# EAGLE design BSPD_RevE (EAGLE 9.2.0)
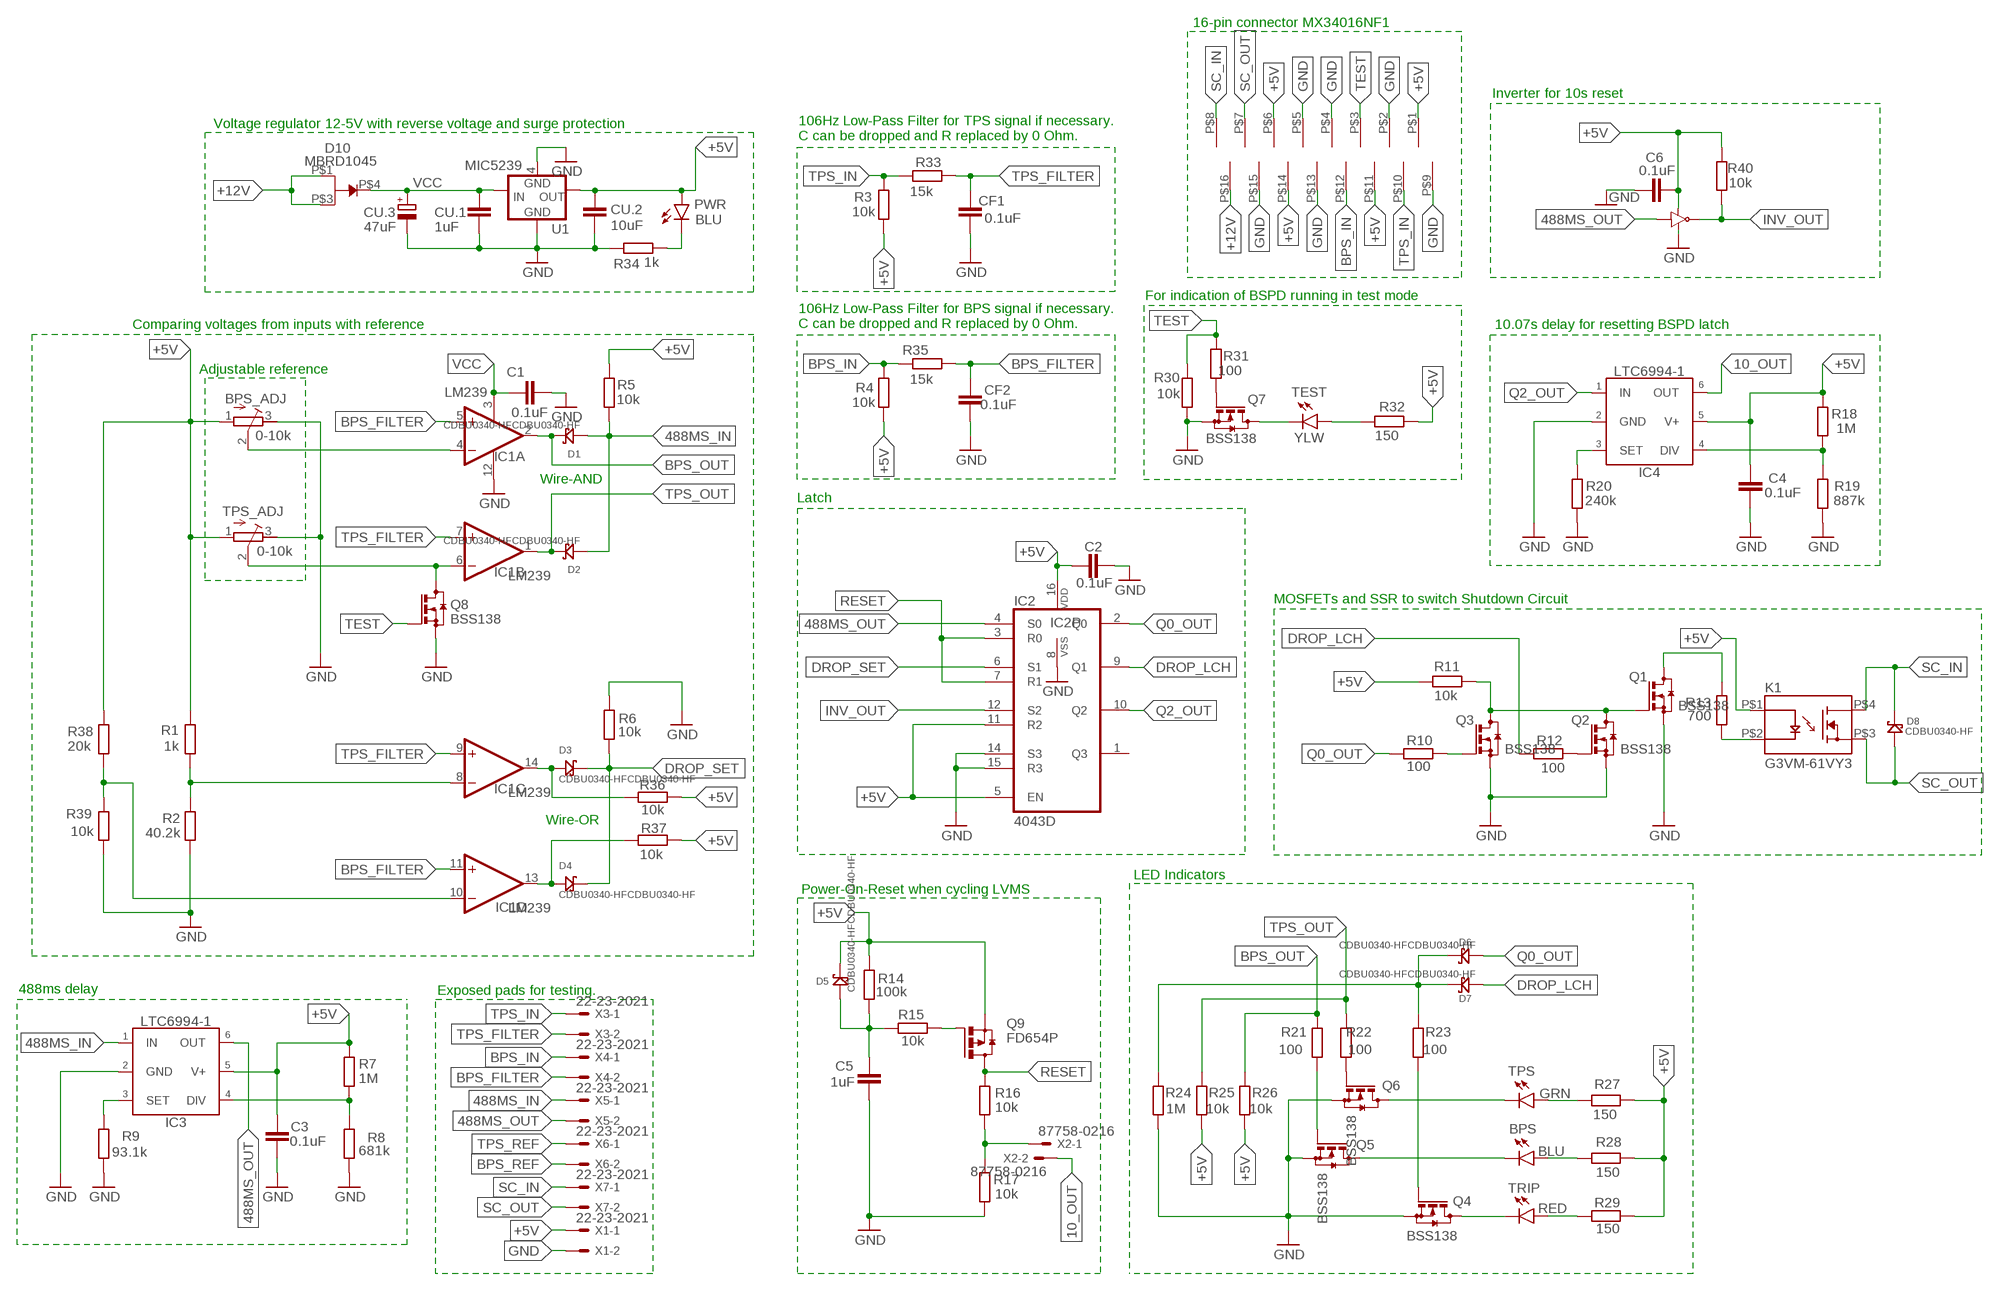
[diagram p0: schematic, sheet 1]

## Parts
BPS  BLU  LEDSML1206  [SML1206]
BPS_ADJ  0-10k  R-TRIMM3296W  [RTRIM3296W]
C1  0.1uF  C-EUC0603  [C0603]
C2  0.1uF  C-EUC0603  [C0603]
C3  0.1uF  C-EUC0603  [C0603]
C4  0.1uF  C-EUC0603  [C0603]
C5  1uF  C-EUC0603  [C0603]
C6  0.1uF  C-EUC0603  [C0603]
CF1  0.1uF  C-EUC0603  [C0603]
CF2  0.1uF  C-EUC0603  [C0603]
CU.1  1uF  C-EUC0603  [C0603]
CU.2  10uF  C-EUC0603  [C0603]
CU.3  47uF  CPOL-EUE2-5  [E2-5]
D1  CDBU0340-HFCDBU0340-HF  [DIOM1709X85]
D2  CDBU0340-HFCDBU0340-HF  [DIOM1709X85]
D3  CDBU0340-HFCDBU0340-HF  [DIOM1709X85]
D4  CDBU0340-HFCDBU0340-HF  [DIOM1709X85]
D5  CDBU0340-HFCDBU0340-HF  [DIOM1709X85]
D6  CDBU0340-HFCDBU0340-HF  [DIOM1709X85]
D7  CDBU0340-HFCDBU0340-HF  [DIOM1709X85]
D8  CDBU0340-HF  CDBU0340-HFCDBU0340-HF  [DIOM1709X85]
D10  MBRD1045  [DPAK]
IC1  LM239  LM2901D  [SO14]
IC2  4043D  [SO16]
IC3  LTC6994-1  [TSOT23-6]
IC4  LTC6994-1  [TSOT23-6]
K1  G3VM-61VY3  [SOP-4]
P1  MX34016NF1  [MX34016NF1]
PWR  BLU  LEDSML1206  [SML1206]
Q1  BSS138  BSS123  [SOT23]
Q2  BSS138  BSS123  [SOT23]
Q3  BSS138  BSS123  [SOT23]
Q4  BSS138  BSS123  [SOT23]
Q5  BSS138  BSS123  [SOT23]
Q6  BSS138  BSS123  [SOT23]
Q7  BSS138  BSS123  [SOT23]
Q8  BSS138  BSS123  [SOT23]
Q9  FD654P  [SOT-23-6]
R1  1k  R-EU_R0603  [R0603]
R2  40.2k  R-EU_R0603  [R0603]
R3  10k  R-EU_R0603  [R0603]
R4  10k  R-EU_R0603  [R0603]
R5  10k  R-EU_R0603  [R0603]
R6  10k  R-EU_R0603  [R0603]
R7  1M  R-EU_R0603  [R0603]
R8  681k  R-EU_R0603  [R0603]
R9  93.1k  R-EU_R0603  [R0603]
R10  100  R-EU_R0603  [R0603]
R11  10k  R-EU_R0603  [R0603]
R12  100  R-EU_R0603  [R0603]
R13  700  R-EU_R0603  [R0603]
R14  100k  R-EU_R0603  [R0603]
R15  10k  R-EU_R0603  [R0603]
R16  10k  R-EU_R0603  [R0603]
R17  10k  R-EU_R0603  [R0603]
R18  1M  R-EU_R0603  [R0603]
R19  887k  R-EU_R0603  [R0603]
R20  240k  R-EU_R0603  [R0603]
R21  100  R-EU_R0603  [R0603]
R22  100  R-EU_R0603  [R0603]
R23  100  R-EU_R0603  [R0603]
R24  1M  R-EU_R0603  [R0603]
R25  10k  R-EU_R0603  [R0603]
R26  10k  R-EU_R0603  [R0603]
R27  150  R-EU_R0603  [R0603]
R28  150  R-EU_R0603  [R0603]
R29  150  R-EU_R0603  [R0603]
R30  10k  R-EU_R0603  [R0603]
R31  100  R-EU_R0603  [R0603]
R32  150  R-EU_R0603  [R0603]
R33  15k  R-EU_R0603  [R0603]
R34  1k  R-EU_R0603  [R0603]
R35  15k  R-EU_R0603  [R0603]
R36  10k  R-EU_R0603  [R0603]
R37  10k  R-EU_R0603  [R0603]
R38  20k  R-EU_R0603  [R0603]
R39  10k  R-EU_R0603  [R0603]
R40  10k  R-EU_R0603  [R0603]
TEST  YLW  LEDSML1206  [SML1206]
TPS  GRN  LEDSML1206  [SML1206]
TPS_ADJ  0-10k  R-TRIMM3296W  [RTRIM3296W]
TRIP  RED  LEDSML1206  [SML1206]
U1  MIC5239  [SOT223]
U2  74LVC1G06  [SOT353-1]
X1  22-23-2021  [22-23-2021]
X2  87758-0216  [87758-0216]
X3  22-23-2021  [22-23-2021]
X4  22-23-2021  [22-23-2021]
X5  22-23-2021  [22-23-2021]
X6  22-23-2021  [22-23-2021]
X7  22-23-2021  [22-23-2021]

## Nets
10_OUT: IC4.6(OUT) X2.2
488MS_IN: D1.2$A(A) D2.2$A(A) IC3.1(IN) R5.1 X5.1
488MS_OUT [Min]: IC2.4(S0) IC3.6(OUT) U2.P$2(A) X5.2
+5V: BPS_ADJ.1(A) C2.1 C3.2 C4.2 C6.2 CU.2.1 D5.1$K(K) IC2.5(EN) IC2.11(R2) IC2.16(VDD) IC3.5(V+) IC4.5(V+) K1.P$1 P1.P$1 P1.P$6 P1.P$11 P1.P$14 PWR.A Q9.4(S) R1.2 R3.1 R4.1 R5.2 R7.2 R11.2 R14.2 R18.2 R25.1 R26.1 R27.2 R28.2 R29.2 R32.2 R36.1 R37.1 R38.2 R40.2 TPS_ADJ.1(A) U1.3(OUT) U2.P$5(VCC) X1.1
+12V: D10.P$1 D10.P$3 P1.P$16
BPS_DROP: D4.2$A(A) IC1.13(D:OUT) R37.2
BPS_FILTER: CF2.2 IC1.5(A:+IN) IC1.11(D:+IN) R35.1 X4.2
BPS_IN: P1.P$12 R4.2 R35.2 X4.1
BPS_OUT: D1.1$K(K) IC1.2(A:OUT) R21.2 R26.2
BPS_REF: BPS_ADJ.2(S) IC1.4(A:-IN) X6.2
DROP_LCH: D7.2$A(A) IC2.9(Q1) R12.2
DROP_SET: D3.1$K(K) D4.1$K(K) IC2.6(S1) R6.1
GND: BPS_ADJ.3(E) C1.2 C2.2 C3.1 C4.1 C5.1 C6.1 CF1.1 CF2.1 CU.1.2 CU.2.2 CU.3.- IC1.12(P:V-) IC2.8(VSS) IC2.14(S3) IC2.15(R3) IC3.2(GND) IC4.2(GND) P1.P$2 P1.P$4 P1.P$5 P1.P$9 P1.P$13 P1.P$15 Q1.2(S) Q2.2(S) Q3.2(S) Q4.2(S) Q5.2(S) Q6.2(S) Q7.2(S) Q8.2(S) R2.1 R6.2 R8.1 R9.1 R17.2 R19.1 R20.1 R24.1 R30.1 R34.1 R39.1 TPS_ADJ.3(E) U1.2(GND) U1.4(GND_TAB) U2.P$3(GND) X1.2
INV_OUT: IC2.12(S2) R40.1 U2.P$4(Y)
LED_DROP: Q7.3(D) TEST.C
N$1: R16.2 R17.1 X2.1
N$2: Q1.3(D) R13.2
N$5: IC1.8(C:-IN) R1.1 R2.2
N$9: IC3.4(DIV) R7.1 R8.2
N$10: Q1.1(G) Q2.3(D) Q3.3(D) R11.1
N$11: R27.1 TPS.A
N$12: BPS.A R28.1
N$13: BPS.C Q5.3(D)
N$14: Q6.3(D) TPS.C
N$15: R29.1 TRIP.A
N$16: Q4.3(D) TRIP.C
N$17: Q2.1(G) R12.1
N$18: C5.2 D5.2$A(A) R14.1 R15.2
N$19: PWR.C R34.2
N$23: K1.P$2 R13.1
N$24: Q5.1(G) R21.1
N$25: Q6.1(G) R22.1
N$27: Q4.1(G) R23.1
N$28: R32.1 TEST.A
N$31: IC4.4(DIV) R18.1 R19.2
N$32: IC4.3(SET) R20.2
N$33: Q3.1(G) R10.2
N$36: Q7.1(G) R31.1
N$38: IC3.3(SET) R9.2
N$40: D6.1$K(K) D7.1$K(K) R23.2 R24.2
N$41: Q9.3(G) R15.1
N$43: IC1.10(D:-IN) R38.1 R39.2
Q0_OUT: D6.2$A(A) IC2.2(Q0) R10.1
Q2_OUT: IC2.10(Q2) IC4.1(IN)
RESET: IC2.3(R0) IC2.7(R1) Q9.1(D) Q9.2(D) Q9.5(D) Q9.6(D) R16.1
SC_IN: D8.1$K(K) K1.P$4 P1.P$8 X7.1
SC_OUT: D8.2$A(A) K1.P$3 P1.P$7 X7.2
TEST: P1.P$3 Q8.1(G) R30.2 R31.2
TPS_DROP: D3.2$A(A) IC1.14(C:OUT) R36.2
TPS_FILTER: CF1.2 IC1.7(B:+IN) IC1.9(C:+IN) R33.1 X3.2
TPS_IN: P1.P$10 R3.2 R33.2 X3.1
TPS_OUT: D2.1$K(K) IC1.1(B:OUT) R22.2 R25.2
TPS_REF: IC1.6(B:-IN) Q8.3(D) TPS_ADJ.2(S) X6.1
VCC: C1.1 CU.1.1 CU.3.+ D10.P$4 IC1.3(P:V+) U1.1(IN)
Unconnected: IC2.1(Q3)

## Notes on the sheet
- 16-pin connector MX34016NF1
- Inverter for 10s reset
- Voltage regulator 12-5V with reverse voltage and surge protection
- 106Hz Low-Pass Filter for TPS signal if necessary.
  C can be dropped and R replaced by 0 Ohm.
- For indication of BSPD running in test mode
- Comparing voltages from inputs with reference | 10.07s delay for resetting BSPD latch
- 106Hz Low-Pass Filter for BPS signal if necessary.
  C can be dropped and R replaced by 0 Ohm.
- Adjustable reference
- Wire-AND
- Latch
- MOSFETs and SSR to switch Shutdown Circuit
- Wire-OR
- LED Indicators
- Power-On-Reset when cycling LVMS
- 488ms delay | Exposed pads for testing.

## Library data of the parts
BPS PWR TEST TPS TRIP = led:LED: LED OSRAM: - CHIPLED LG R971, LG N971, LY N971, LG Q971, LY Q971, LO R971, LY R971 LH N974, LH R974 LS Q976, LO Q976, LY Q976 LO Q996 - Hyper CHIPLED LW Q18S LB Q993, LB Q99A, LB R99A - SideLED LS A670, LO A670, LY A670, LG A670, LP A670 LB A673, LV A673, LT A673, LW A673 LH A674 LY A675 LS A676, LA A676, LO A676, LY A676, LW A676 LS A679, LY A679, LG A679 - Hyper Micro SIDELED® LS Y876, LA Y876, LO Y876, LY Y876 LT Y87S - SmartLED LW L88C, LW L88S LB L89C, LB L89S, LG L890 LS L89K, LO L89K, LY L89K LS L896, LA L896, LO L896, LY L896 - TOPLED LS T670, LO T670, LY T670, LG T670, LP T670 LSG T670, LSP T670, LSY T670, LOP T670, LYG T670 LG T671, LOG T671, LSG T671 LB T673, LV T673, LT T673, LW T673 LH T674 LS T676, LA T676, LO T676, LY T676, LB T676, LH T676, LSB T676, LW T676 LB T67C, LV T67C, LT T67C, LS T67K, LO T67K, LY T67K, LW E67C LS E67B, LA E67B, LO E67B, LY E67B, LB E67C, LV E67C, LT E67C LW T67C LS T679, LY T679, LG T679 LS T770, LO T770, LY T770, LG T770, LP T770 LB T773, LV T773, LT T773, LW T773 LH T774 LS E675, LA E675, LY E675, LS T675 LS T776, LA T776, LO T776, LY T776, LB T776 LHGB T686 LT T68C, LB T68C - Hyper Mini TOPLED® LB M676 - Mini TOPLED Santana® LG M470 LS M47K, LO M47K, LY M47K Source: http://www.osram.convergy.de LUXEON: - LUMILED® LXK2-PW12-R00, LXK2-PW12-S00, LXK2-PW14-U00, LXK2-PW14-V00 LXK2-PM12-R00, LXK2-PM12-S00, LXK2-PM14-U00 LXK2-PE12-Q00, LXK2-PE12-R00, LXK2-PE12-S00, LXK2-PE14-T00, LXK2-PE14-U00 LXK2-PB12-K00, LXK2-PB12-L00, LXK2-PB12-M00, LXK2-PB14-N00, LXK2-PB14-P00, LXK2-PB14-Q00 LXK2-PR12-L00, LXK2-PR12-M00, LXK2-PR14-Q00, LXK2-PR14-R00 LXK2-PD12-Q00, LXK2-PD12-R00, LXK2-PD12-S00 LXK2-PH12-R00, LXK2-PH12-S00 LXK2-PL12-P00, LXK2-PL12-Q00, LXK2-PL12-R00 Source: www.luxeon.com KINGBRIGHT: KA-3528ASYC Source: www.kingbright.com
BPS_ADJ TPS_ADJ = rcl:R-TRIMM: Trimm resistor; SPICEMODEL: X; SPICEPREFIXL: POT
C1-C6 CF1 CF2 CU.1 CU.2 = rcl:C-EU: CAPACITOR, European symbol; SPICEPREFIX: C
CU.3 = rcl:CPOL-EU: POLARIZED CAPACITOR, European symbol; SPICEPREFIX: C
D1-D7 = BSPD:CDBU0340-HF
D8 = AR19_ETC:CDBU0340-HF
D10 = AR19_ETC:MBRD1045
IC1 = linear:LM2901: COMPARATOR
IC2 = 40xx:4043: Quad 3-state NOR R/S LATCH
IC3 IC4 = div1:LTC6994-1: TimerBlox Retriggerable One Edge Delay; SPICEMODEL: LTC6994-1.sub; VALUE2: LTC6994-1
K1 = AR19_ETC:G3VM-61VY3
P1 = AR19_ETC:MX34016NF1
Q1-Q8 = transistor-small-signal:BSS123: N-CHANNEL MOS FET
Q9 = BSPD:FD654P
R1-R40 = rcl:R-EU_: RESISTOR, European symbol; SPICEPREFIX: R
U1 = BSPD:MIC5239
U2 = AR19_ETC:74LVC1G06
X1 X3-X7 = con-molex:22-23-2021: .100" (2.54mm) Center Header - 2 Pin; MF: MOLEX; MPN: 22-23-2021; OC_FARNELL: 1462926; OC_NEWARK: 25C3832
X2 = con-molex:87758-0216: 2 Pin - 2mm Dual Row Single Wafer, Vertical T/H HDR Source: http://www.molex.com/pdm_docs/sd/877580616_sd.pdf; MF: MOLEX; MPN: 87758-0216; OC_FARNELL: unknown; OC_NEWARK: 94M1513

## Net classes
0 default: width 0.152 mm, drill 0.3 mm, clearance 0.127 mm
1 PWR: width 0.762 mm, drill 0.254 mm, clearance 0.127 mm
2 GND: width 0.762 mm, drill 0.254 mm, clearance 0.127 mm
3 Min: width 0.152 mm, drill 0.254 mm, clearance 0.127 mm

## Board
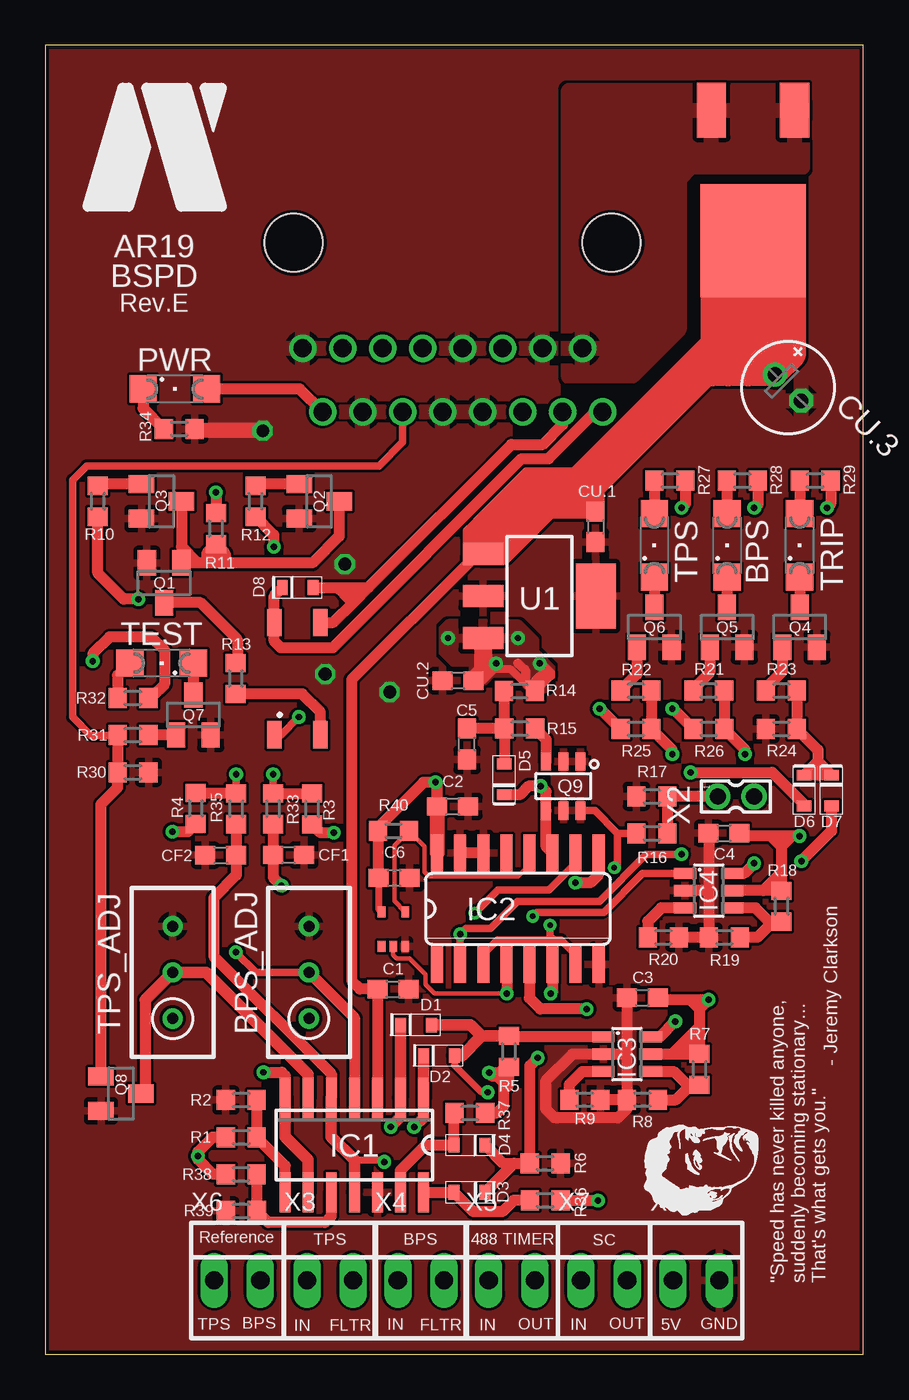
[diagram p1: board, top side]
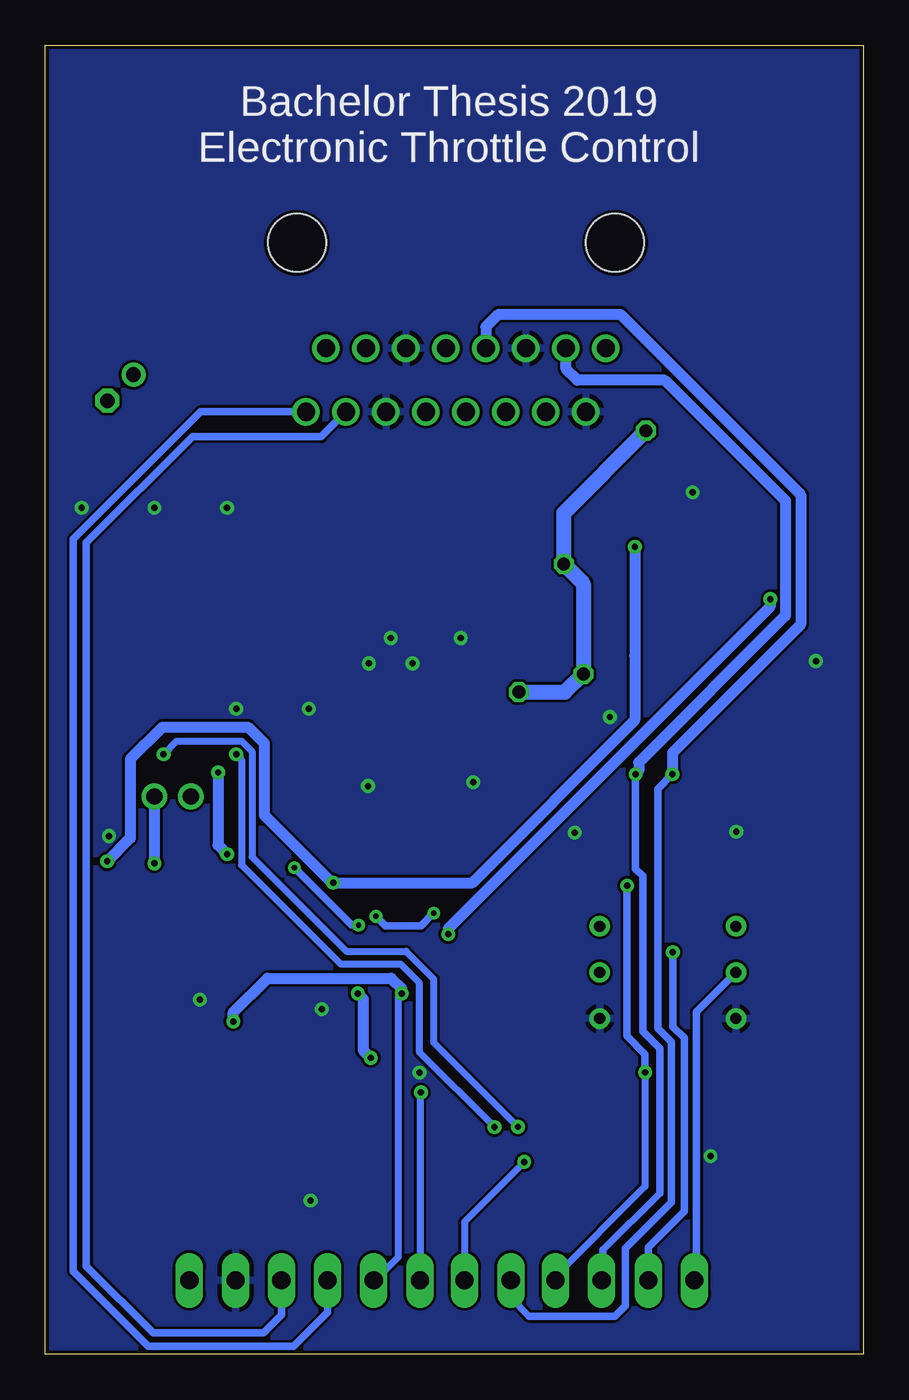
[diagram p2: board, bottom side, seen from below]

Size 45 x 72 mm. Coordinates in mm from the lower left corner, seen from the top.
Outline: 0,0 45,0 45,72 0,72 0,0
Copper layers (1*16): Top 0.035mm / dielectric 1.5mm / Bottom 0.035mm
Design rules "default *": minimum track width 6mil, minimum drill 0.3mm, track to track 6mil, track to pad 6mil, pad to pad 6mil, via to via 6mil, smd to smd 6mil, copper to edge 0.2mm, drill to drill 6mil, minimum pad ring 10mil, minimum via ring 8mil, stop-mask expansion 4mil, vias tented up to drill 0mil, thermal gap 10mil

### Footprints (pad centres in the part's own frame; a part is rotated, then mirrored left to right if it is on the bottom)
SML1206 = smd 1.5 x 1.5: A 1.75,0; C -1.75,0
RTRIM3296W = drill 0.61: 1 0,-2.54; 2 0,0; 3 0,2.54
C0603 = smd 1.1 x 1: 1 -0.85,0; 2 0.85,0
E2-5 = drill 0.813 pad 1.27: + -1.016,0 | drill 0.813 pad 1.27 octagon: - 1.016,0
DIOM1709X85 = smd 0.6 x 0.8: 1$K -0.85,0; 2$A 0.85,0
DPAK = smd 3 x 1.6: P$1 0,0; P$3 0,4.57 | smd 6.2 x 5.8: P$4 -7.18,2.285
SO14 = smd 0.6 x 2.2: 1 -3.81,-2.6; 2 -2.54,-2.6; 3 -1.27,-2.6; 4 0,-2.6; 5 1.27,-2.6; 6 2.54,-2.6; 7 3.81,-2.6; 8 3.81,2.6; 9 2.54,2.6; 10 1.27,2.6; 11 0,2.6; 12 -1.27,2.6; 13 -2.54,2.6; 14 -3.81,2.6
SO16 = smd 0.66 x 2.032: 1 -4.445,-3.073; 2 -3.175,-3.073; 3 -1.905,-3.073; 4 -0.635,-3.073; 5 0.635,-3.073; 6 1.905,-3.073; 7 3.175,-3.073; 8 4.445,-3.073; 9 4.445,3.073; 10 3.175,3.073; 11 1.905,3.073; 12 0.635,3.073; 13 -0.635,3.073; 14 -1.905,3.073; 15 -3.175,3.073; 16 -4.445,3.073
TSOT23-6 = smd 0.62 x 1.22: 1 -0.95,-1.3; 2 0,-1.3; 3 0.95,-1.3; 4 0.95,1.3; 5 0,1.3; 6 -0.95,1.3
SOP-4 = smd 0.8 x 1.5: P$1 0,0; P$2 2.54,0; P$3 2.54,6.18; P$4 0,6.18
MX34016NF1 = drill 1: P$1 0,0; P$2 -2.2,0; P$3 -4.4,0; P$4 -6.6,0; P$5 -8.8,0; P$6 -11,0; P$7 -13.2,0; P$8 -15.4,0; P$9 1.1,-3.5; P$10 -1.1,-3.5; P$11 -3.3,-3.5; P$12 -5.5,-3.5; P$13 -7.7,-3.5; P$14 -9.9,-3.5; P$15 -12.1,-3.5; P$16 -14.3,-3.5 | hole 3.2: -15.9,-9.3; 1.6,-9.3
SOT23 = smd 1 x 1.4: 1 -0.95,-1.1; 2 0.95,-1.1; 3 0,1.1
SOT-23-6 = smd 1 x 0.55: 1 -1.35,0.95; 2 -1.35,0; 3 -1.35,-0.95; 4 1.35,-0.95; 5 1.35,0; 6 1.35,0.95
R0603 = smd 1 x 1.1: 1 -0.85,0; 2 0.85,0
SOT223 = smd 1.219 x 2.235: 1 -2.311,-3.099; 2 0,-3.099; 3 2.311,-3.099 | smd 3.6 x 2.2: 4 0,3.099
SOT353-1 = smd 0.42 x 0.6: P$1 -0.65,0; P$2 0,0; P$3 0.65,0; P$4 0.65,1.9; P$5 -0.65,1.9
22-23-2021 = drill 1 long: 1 -1.27,0; 2 1.27,0
87758-0216 = drill 0.9 pad 1.27: 1 0,-1; 2 0,1

### Placement (x,y rotation side)
BPS  37.51,44.5 90 top
BPS_ADJ  14.5,21 0 top
C1  19.12,20.08 0 top
C2  22.41,30.13 0 top
C3  32.85,19.61 0 top
C4  37.34,28.66 0 top
C5  23.2,33.56 90 top
C6  19.19,26.19 180 top
CF1  13.38,27.46 180 top
CF2  9.65,27.45 0 top
CU.1  30.27,45.52 270 top
CU.2  22.71,37.05 180 top
CU.3  40.87,53.17 315 top
D1  20.4,18.11 0 top
D2  21.66,16.42 0 top
D3  23.34,8.9 180 top
D4  23.33,11.5 180 top
D5  25.24,31.62 90 top
D6  41.75,31 270 top
D7  43.25,31 270 top
D8  13.89,42.17 0 top
D10  41.23,68.44 90 top
IC1  17,11.5 180 top
IC2  26,24.5 0 top
IC3  32,16.5 270 top
IC4  36.5,25.5 270 top
K1  12.59,34.07 0 top
P1  15.26,51.84 180 top
PWR  7.13,53.1 0 top
Q1  6.53,42.43 180 top
Q2  15.06,46.92 270 top
Q3  6.38,46.92 270 top
Q4  41.51,40 0 top
Q5  37.51,40 0 top
Q6  33.51,40 0 top
Q7  8.14,35.16 0 top
Q8  4.16,14.33 270 top
Q9  28.5,31.25 270 top
R1  10.78,11.93 180 top
R2  10.78,13.98 0 top
R3  14.69,30 90 top
R4  8.28,30.02 90 top
R5  25.5,16.65 270 top
R6  27.5,10.5 0 top
R7  35.99,15.66 90 top
R8  32.85,14 0 top
R9  29.68,14 180 top
R10  2.88,46.92 90 top
R11  9.38,45.42 90 top
R12  11.56,46.92 270 top
R13  10.48,37.17 90 top
R14  26.09,36.47 0 top
R15  26.1,34.41 180 top
R16  33.37,28.65 0 top
R17  33.37,30.68 180 top
R18  40.5,24.64 90 top
R19  37.36,22.93 0 top
R20  34,22.93 180 top
R21  36.5,36.5 0 top
R22  32.5,36.5 0 top
R23  40.5,36.5 0 top
R24  40.5,34.4 0 top
R25  32.5,34.4 0 top
R26  36.51,34.4 0 top
R27  34.37,48.06 0 top
R28  38.36,48.06 0 top
R29  42.36,48.06 0 top
R30  4.82,32.01 180 top
R31  4.82,34.06 180 top
R32  4.82,36.1 0 top
R33  12.53,30 90 top
R34  7.37,50.9 180 top
R35  10.5,30 90 top
R36  27.51,8.47 180 top
R37  23.35,13.26 180 top
R38  10.78,9.9 180 top
R39  10.78,7.87 0 top
R40  19.16,28.78 180 top
TEST  6.4,38.02 180 top
TPS  33.51,44.5 90 top
TPS_ADJ  7,21 0 top
TRIP  41.51,44.5 90 top
U1  27.19,41.71 270 top
U2  19.15,22.43 0 top
X1  35.81,4.05 0 top
X2  38,30.68 270 top
X3  15.66,4.05 0 top
X4  20.66,4.05 0 top
X5  25.66,4.05 0 top
X6  10.55,4.05 0 top
X7  30.74,4.05 0 top

### Tracks (layer width: path | path; a pad name or v marks a point on that pad's centre or on a via)
10_OUT  (via drill 0.35)
  Top 0.61: v39,27 38.45,26.45 IC4.6
  Bottom 0.61: v39,27 X2.2
488MS_IN  (via drill 0.35)
  Top 0.381: D2.2$A 22.51,15.89 24,14.4 v24.34,14.4
  Top 0.61: IC3.1 25.55,17.45 R5.1
  Top 0.635: D2.2$A 22.92,16.42 24,17.5 | D1.2$A 23.39,18.11 24,17.5 | R5.1 24,17.5
  Bottom 0.381: v24.34,14.4 24.39,14.35 X5.1
488MS_OUT  (via drill 0.35)
  Top 0.254: v25.39,19.84 21.4,19.84 20.9,20.34 20.9,20.9 20.03,21.77 19.33,21.77 19.14,21.96 19.14,22.43 U2.P$2
  Top 0.61: IC3.6 33.8,17.45 v34.65,18.3 v34.66,18.3 | IC2.4 25.39,21.4 v25.39,19.84
  Bottom 0.381: v25.39,19.84 25.59,19.64 25.59,5.33 26.84,4.08 X5.2
  Bottom 0.61: v25.39,19.84 25.39,20.09 25.97,20.68 32.78,20.68 34.66,18.8 v34.66,18.3
+5V  (via drill 0.35)
  Top 0.381: C6.2 18.34,24.49 U2.P$5
  Top 0.4: v13.94,35.05 12.96,34.07 K1.P$1 | 24.71,37.69 25.58,37.69 26.8,36.47 R14.2 | 24.71,37.69 24.09,37.69 | 24.71,37.69 24.07,37.05 CU.2.1 | 24.71,37.69 24.09,38.31 24.09,38.62
  Top 0.508: R14.2 26.44,36.97 26.44,37.6 26,38 | R14.2 27.79,37.32 27.79,37.48 27.59,37.68 | 27.59,37.68 27.23,38.04 v27.2,38 | R14.2 26.94,37.02 27.59,37.68
  Top 0.6: R38.2 9.21,9.9 8.39,10.71 v8.39,10.89 8.39,11.13 9.19,11.93 R1.2 | IC2.11 27.55,27.93 Q9.4 | v27.25,31.25 26.59,31.25 26.11,30.77 D5.1$K | P1.P$1 14,53.1 PWR.A | v21.46,31.46 20.8,31.46 18.31,28.98 R40.2 18.31,26.22 C6.2
  Top 0.61: R4.1 7.84,28.73 v6.99,28.73 v6.98,28.73 | R5.2 25.31,15.8 24.99,15.48 v24.41,15.48 24.6,15.3 24.85,15.3 25.21,14.94 | 39.5,25.5 IC4.5 | R18.2 39.5,25.5 | R18.2 | C4.2 38.35,28.5 39.91,28.5 | 40.5,28.5 v41.5,28.5 41.07,28.5 40.49,27.92 39.91,28.5 | 40.5,28.5 39.91,28.5 | 40.49,26.49 40.49,28.49 40.5,28.5 | 40.49,26.49 R18.2 | 40.49,26.49 39.5,25.5 | v9.38,47.42 R11.2 | 35.48,19.5 v36.5,19.5 35.99,18.99 | 35.48,19.5 33.81,19.5 C3.2 | 35.99,18.99 35.99,18 | 35.99,18 35.99,17.5 | 35.99,17.5 R7.2 35,16.51 | 35.99,18.99 35.48,19.5 | IC3.5 34.5,16.51 | 34.5,16.51 35,16.51 | 34.5,16.51 35.99,18 | 35,16.51 35.99,17.5 | R27.2 35.22,46.77 v35.01,46.56 | R28.2 39.21,46.76 v39.01,46.56 | R29.2 43.21,46.76 v43.01,46.56 | R32.2 5.72,36.15 5.85,36.15 6.55,36.85 6.55,38.74 5.82,39.46 3.53,39.46 2.6,38.53 v2.6,38.13 | v34.5,35.5 34.56,35.5 R26.1 | v30.5,35.5 30.55,35.5 R25.1 | Q9.4 27.55,30.95 v27.25,31.25 | v30.41,8.44 28.38,8.44 R36.1 | 25.21,14.94 25.21,14.53 | 25.21,14.53 25.21,13.64 24.82,13.25 24.21,13.25 R37.1 | R5.2 25.21,15.51 25.21,14.94 | 25.21,14.53 25.5,14.82 R5.2 | v15.88,28.68 15.15,28.68 R3.1 | v29.79,18.98 27.24,18.98 26.64,19.59 IC2.5
  Top 0.635: C2.1 21.56,31.37 v21.46,31.46
  Top 0.813: C2.1 IC2.16
  Top 1: U1.3 24.09,38.62 24.09,37.69 24.09,37.59 CU.2.1
  other vias: 22.15,39.4 26,39.4 24.8,38
  pour Bottom (rank 2): -1,72.78 46,72.78 46,-1 -1,-1
  pour Top: 24.33,40.18 22.18,40.18 21.87,39.88 21.87,38.63 22.19,38.32 22.43,38.07 22.85,38.07 23.51,37.4 23.51,37.01 24.12,37.01 24.58,37.47 25.81,37.47 26.66,36.62 27.56,36.62 27.82,36.89 27.82,37.74 26.93,38.63 26.93,39.26 26.03,40.16
+12V
  pour Top: 28.78,53.78 28.78,69.53 41.65,69.53 41.65,65.3 35.52,65.3 34.88,64.65 34.88,56.39 32.31,53.82
BPS_DROP
  Top 0.61: IC1.13 19.54,10.11 20.93,11.5 D4.2$A 22.48,13.24 R37.2
BPS_FILTER  (via drill 0.35)
  Top 0.381: 17,10.7 18.52,10.7 v18.65,10.57
  Top 0.61: R35.1 CF2.2 10.5,26.35 9.26,25.11 9.26,21.88 15.73,15.41 IC1.5
  Top 0.635: IC1.11 17,10.7 15.73,11.96 IC1.5 | IC1.11
  Bottom 0.381: v18.65,10.57 21.93,7.29 X4.2
BPS_IN  (via drill 0.35)
  Top 0.4: v10.5,31.9 R35.2
  Top 0.61: R4.2 10.48,30.87 R35.2
  Bottom 0.381: 19.39,3.08 18.39,2.08
  Bottom 0.4: v10.5,31.9 11.3,31.1 11.3,17.93
  Bottom 0.406: 18.39,2.08 13.66,2.08 13.09,2.67 13.09,5.82 10.55,8.35 10.55,17.18 11.3,17.93 | X4.1 19.39,3.08
  Bottom 0.6: v10.5,31.9 10.5,33.07 3.44,40.13 3.44,47.28 13.37,57.21 20.07,57.21 20.76,56.52 P1.P$12
BPS_OUT  (via drill 0.35)
  Top 0.61: R21.2 R26.2 38.5,33.26 v38.5,33 | IC1.2 19.54,13.04 v19,12.5
  Top 0.635: IC1.2 D1.1$K
  Bottom 0.381: v19,12.5 23.64,17.14 23.64,20.64 25.16,22.16 28.44,22.16 33.64,27.36 33.64,33.16 34.2,33.72 37.78,33.72 v38.5,33
BPS_REF  (via drill 0.35)
  Top 0.406: BPS_ADJ.2 11.59,20.99 v10.48,22.11
  Top 0.6: BPS_ADJ.2 17,18.5 IC1.4
  Bottom 0.4: X6.2 11.82,5.87 9.85,7.85 9.85,17.38 10.48,18.01 v10.48,22.11
DROP_LCH  (via drill 0.35)
  Top 0.61: IC2.9 30.45,26.39 29.98,25.93 v29.17,25.93 | R12.2 12.56,45.07 v12.56,44.42 | D7.2$A 43.25,28.78 41.6,27.13 v41.6,27.11
  Bottom 0.6: 12.56,38.42 12.56,34.88 21.51,25.93 v29.17,25.93
  Bottom 0.61: v12.56,44.42 v12.56,44.41 12.56,38.43 12.56,38.42 | v29.17,25.93 29.23,25.93 32.96,29.66 32.96,33.61 33.85,34.5 38.56,34.5 40.33,32.73 40.33,28.38 v41.6,27.11
DROP_SET  (via drill 0.35)
  Top 0.61: D3.1$K 25.79,10.5 R6.1 | D4.1$K 25.18,10.5 R6.1 | IC2.6 27.91,19.93 v27.81,19.84 | R6.1 26.65,15.86 v27.09,16.3
  Bottom 0.61: v27.09,16.3 27.51,16.72 27.51,19.54 v27.81,19.84
GND  (via drill 0.7)
  Top 0.61: R8.1 R9.1 | 32,16.5 R8.1 | 32,16.5 IC3.2 29,16.5 27.52,15.02 27.52,13.48 28,13 28.13,13 28.14,12.99 31.49,12.99 32,13.5 R8.1 | C3.1 32,16.5 | IC2.14 IC2.15 | C4.1 36.5,25.5 | 36.5,25.5 IC4.2 | 36.5,25.5 R19.1 R20.1
  Top 0.813: v11.96,50.8 8.32,50.8 R34.1
  Bottom 0.813: v18.95,36.42 18.94,36.41 16.4,36.41 v15.39,37.42 15.39,42.38 v16.48,43.47 16.48,46.28 v11.96,50.8
  pour Top (rank 2): 12.46,72.25 45.5,72.25 45.5,48.9 12.46,48.9
  pour Top (rank 2): -0.45,49.3 45.41,49.3 45.41,-0.19 -0.37,-0.19 -0.37,22.15
  pour Top: -0.36,72.23 12.67,72.23 12.67,48.81 -0.39,48.81 -0.39,70.85
INV_OUT
  Top 0.254: U2.P$4 19.21,24.92 19.21,27.98 R40.1 20.87,27.93 20.87,26.52 21.11,26.28 26.01,26.28 26.51,26.78 26.51,27.45 IC2.12
LED_DROP
  Top 0.61: Q7.3 8.14,38.01 TEST.C
N$1
  Top 0.61: X2.1 R17.1 R16.2
N$2
  Top 0.6: R13.2 10.57,38.12 10.57,39.31 8.53,41.35 6.55,41.35
  Top 0.61: 6.55,41.35 Q1.3
N$5
  Top 0.6: 11.62,11.94 R1.1 13.19,10.37 IC1.8
  Top 0.61: R2.2 R1.1
N$9
  Top 0.61: R8.2 34.7,14 35.51,14.81 R7.1 35.32,14.81 34.58,15.55 IC3.4
N$10
  Top 0.61: Q1.1 7.49,44.42 8.38,43.53 | 9.88,43.53 14.69,43.53 16.16,45 Q2.3 | 9.88,43.53 9.38,43.53 | 9.38,43.53 8.88,43.53 | 8.88,43.53 8.38,43.53 | 8.38,43.53 Q1.1 | R11.1 9.38,43.53 | R11.1 8.88,44.07 8.88,43.53 | R11.1 9.88,44.07 9.88,43.53 | Q3.3 Q1.1
N$11
  Top 0.61: R27.1 33.51,48.05 TPS.A
N$12
  Top 0.61: R28.1 BPS.A
N$13
  Top 0.61: BPS.C Q5.3
N$14
  Top 0.61: TPS.C Q6.3
N$15
  Top 0.61: R29.1 TRIP.A
N$16
  Top 0.61: TRIP.C Q4.3
N$17
  Top 0.61: Q2.1 11.66,47.87 R12.1
N$18
  Top 0.6: R15.2 25.25,32.48 D5.2$A
  Top 0.61: C5.2 R15.2 R14.1
N$19
  Top 0.6: R34.2 5.38,52.04 PWR.C
N$23
  Top 0.6: R13.1 14.13,36.32 15.13,35.32 K1.P$2
N$24
  Top 0.61: Q5.1 36.56,37.51 35.65,36.6 R21.1
N$25
  Top 0.61: Q6.1 32.56,37.41 R22.1
N$27
  Top 0.61: Q4.1 40.56,37.56 39.65,36.65 R23.1
N$28
  Top 0.61: TEST.A 3.97,37.34 R32.1
N$31
  Top 0.61: R19.2 39.18,22.93 40.04,23.79 R18.1 39.83,23.79 39.07,24.55 IC4.4
N$32
  Top 0.61: R20.2 33.15,23.81 33.89,24.55 IC4.3
N$33
  Top 0.61: Q3.1 2.98,47.87 R10.2
N$36
  Top 0.61: R31.1 Q7.1
N$38
  Top 0.61: R9.2 28.83,14.83 29.55,15.55 IC3.3
N$40
  Top 0.61: R23.2 R24.2 42.51,33.24 42.51,32.5 | 42.51,31.85 D6.1$K 42.4,32.5 42.51,32.5 | 42.51,31.85 D7.1$K 42.6,32.5 42.51,32.5 | 42.51,32.5 42.51,31.85
N$41
  Top 0.61: R15.1 27.55,33.81 Q9.3
N$43
  Top 0.6: IC1.10 15.73,7.59 15.38,7.25 12.26,7.25 R39.2 11.63,7.88 R38.1
Q0_OUT  (via drill 0.35)
  Top 0.4: v35,27.5 33.06,27.5 30.47,24.92 25.98,24.92 24.49,23.42 23.15,23.42 v22.83,23.1 v22.82,23.09 IC2.2
  Top 0.61: v5.11,41.53 4.32,41.53 2.88,42.96 R10.1 | v35.5,32 40,32 41.75,30.25 D6.2$A
  Bottom 0.61: v22.83,23.1 22.83,23.41 5.11,41.13 v5.11,41.53 | v35.5,32 35.5,28 v35,27.5
Q2_OUT  (via drill 0.3)
  Top 0.4: IC2.10 29.17,27 27.7,25.53 24.9,25.53 v23.63,24.26 | v26.81,24.08 26.82,24.08 27.05,24.3 30.73,24.3 32.86,26.44 IC4.1
  Bottom 0.4: v23.63,24.26 24.33,23.56 26.29,23.56 v26.81,24.08
RESET  (via drill 0.3)
  Top 0.4: IC2.3 24.11,21.44 24.11,22.01 24.89,22.8 27.99,22.8 | IC2.7 29.18,22 28.38,22.8 27.99,22.8 | Q9.6 30.24,29.9 31.49,28.65 | 31.49,28.65 R16.1 | 31.49,28.65 31.49,26.95 v31.3,26.76 | v27.77,23.6 27.77,23.01 27.99,22.8
  Bottom 0.4: v31.3,26.76 28.14,23.6 v27.77,23.6
  pour Top: 28.05,33.14 29.7,33.14 29.7,29.4 28.01,29.4 28.01,32.4 28.02,32.4
SC_IN
  Top 0.6: D8.1$K 12.59,41.73 K1.P$4 12.59,39.22 12.94,38.87 15.82,38.87 26.21,49.26 27.69,49.26 30.27,51.84 P1.P$8
  Bottom 0.4: P1.P$8 36.47,51.84 43.47,44.84 43.47,4.55 39.36,0.44 31.35,0.44 29.48,2.31 X7.1
SC_OUT
  Top 0.4: 16.88,42.17 16.88,41.38 16.93,41.34
  Top 0.6: 16.21,42.17 16.88,42.17 17.76,42.17 | D8.2$A 16.21,42.17 | 16.93,41.34 15.84,40.25 K1.P$3 | 17.76,42.17 16.93,41.34 | P1.P$7 28.46,51.13 27.38,50.05 25.64,50.05 17.76,42.17 | 16.93,41.34 16.57,41.69 | 16.93,41.34 16.57,41.69 | 16.57,41.69 | 16.57,41.69 16.21,42.05 16.21,42.17
  Bottom 0.4: P1.P$7 29.82,50.48 36.91,50.48 42.75,44.64 42.75,4.84 39.08,1.17 32.99,1.17 32.02,2.15 X7.2
TEST
  Top 0.4: P1.P$3 19.66,50.17 18.36,48.86 2.26,48.86 1.49,48.09 1.49,35.05 2.49,34.05 3.98,34.05
  Top 0.61: R31.2 3.98,34.05 R30.2 3.97,31.17 3.06,30.26 Q8.1
TPS_DROP
  Top 0.61: IC1.14 D3.2$A 23.55,7.84 25.14,7.84 25.77,8.47 R36.2
TPS_FILTER  (via drill 0.35)
  Top 0.61: R33.1 CF1.2 12.53,26.23 v12.99,25.77 | v12,15.5 13.01,15.5 13.19,15.32 IC1.7
  Top 0.635: IC1.9 14.46,10.7 13.19,11.96 IC1.7 | IC1.9
  Bottom 0.381: v12,15.5 12,9.22 16.93,4.28 X3.2
  Bottom 0.4: v12,15.5 12,16.5 13,17.5 v13,25.76
  Bottom 0.61: v13,25.76 v12.99,25.77
TPS_IN  (via drill 0.35)
  Top 0.4: v12.53,31.9 R33.2
  Top 0.61: R33.2 R3.2
  Bottom 0.381: 14.32,5.74 11.2,8.86
  Bottom 0.4: v12.53,31.9 12.53,26.69 12.13,26.3 12.13,17.77 11.2,16.83
  Bottom 0.406: 11.2,8.86 11.2,16.83 | 14.32,5.74 14.32,4.16 X3.1
  Bottom 0.6: v12.53,31.9 12.35,32.08 12.35,32.56 4.28,40.63 4.28,46.95 10.91,53.58 15.73,53.58 16.35,54.2 P1.P$10
TPS_OUT  (via drill 0.35)
  Top 0.61: R22.2 R25.2 34.5,33.25 v34.5,33 | IC1.1 20.81,13.01 v20.29,12.49
  Top 0.635: D2.1$K IC1.1
  Bottom 0.381: v34.5,33 34.21,32.71 34.21,26.91 28.75,21.45 25.46,21.45 24.44,20.44 24.44,16.64 v20.29,12.49
TPS_REF
  Top 0.61: 5.5,19.5 5.5,14.57 Q8.3
  Top 0.635: IC1.6 14.46,15.39 8.86,21 TPS_ADJ.2 5.5,19.5 | IC1.6
  Bottom 0.4: TPS_ADJ.2 9.18,18.82 9.18,4.15 X6.1
VCC
  Top 0.4: 23.34,44.76 U1.1 28.66,48.59 | 23.34,44.76 23.17,44.94 | 23.17,44.94 23.17,45.3 | 26.78,48.59 26.46,48.59 23.83,45.96 | 26.78,48.59 27.23,48.59 | 27.23,48.59 27.74,48.59 | 27.74,48.59 28.19,48.59 | 28.19,48.59 28.66,48.59 | 28.66,48.59 29.67,48.59 25.85,44.76 23.34,44.76 | 23.17,45.3 23.52,45.65 | 23.52,45.65 23.83,45.96 | 23.17,44.94 23.17,43.85 23.38,43.64 | 23.17,44.94 24.55,44.94 28.19,48.59 | 23.17,45.3 24.45,45.3 27.74,48.59 | 23.52,45.65 24.29,45.65 27.23,48.59 | 23.83,45.96 24.15,45.96 26.78,48.59
  Top 0.6: IC1.3 C1.1 18.2,20.08 18.19,20.09 17.31,20.09 16.86,20.54 16.86,37.11 23.38,43.64 23.86,44.11 24,44.11 U1.1
  Top 0.813: 29.18,46.37 27.45,46.37 25.1,44.02 | CU.1.1 29.28,46.37 | 29.28,46.37 29.18,46.37 | 29.18,46.37 28.32,47.23 | 29.28,46.37 28.85,46.8 28.85,47.77
  Top 1: 36.67,53.99 30.27,47.59 CU.1.1 29.36,47.28 29.36,47.31 | 35.41,53.89 35.41,53.36 29.36,47.31 | 29.36,47.31 28.85,46.8
  Top 1.27: CU.3.+ 38.67,53.89 | 38.67,53.89 37.55,53.89 | 37.55,53.89 36.67,53.89 | 36.67,53.89 35.41,53.89 34.97,53.89 | 34.97,53.89 29.67,48.59 28.85,47.77 28.32,47.23 25.1,44.02 U1.1 | D10.P$4 36.67,58.99 36.67,53.99 36.67,53.89 | D10.P$4 41.21,58.99 41.21,54.94 CU.3.+ | D10.P$4 37.55,59.87 37.55,53.89 | D10.P$4 38.67,60.99 38.67,53.89 | D10.P$4 40.15,60.04 CU.3.+ | 38.94,57.86 34.97,53.89 | D10.P$4 38.94,55.1 CU.3.+

### Text on the board
tPlace: AR19 | BSPD | Rev.E | - Jeremy Clarkson | Reference | TPS | BPS | 488 TIMER | SC | "Speed has never killed anyone, / suddenly becoming stationary... / That's what gets you." | TPS | BPS | IN | FLTR | IN | FLTR | IN | OUT | IN | OUT | 5V | GND
bPlace: Bachelor Thesis 2019 / Electronic Throttle Control